# EAGLE design untitled (EAGLE 7.6.0)
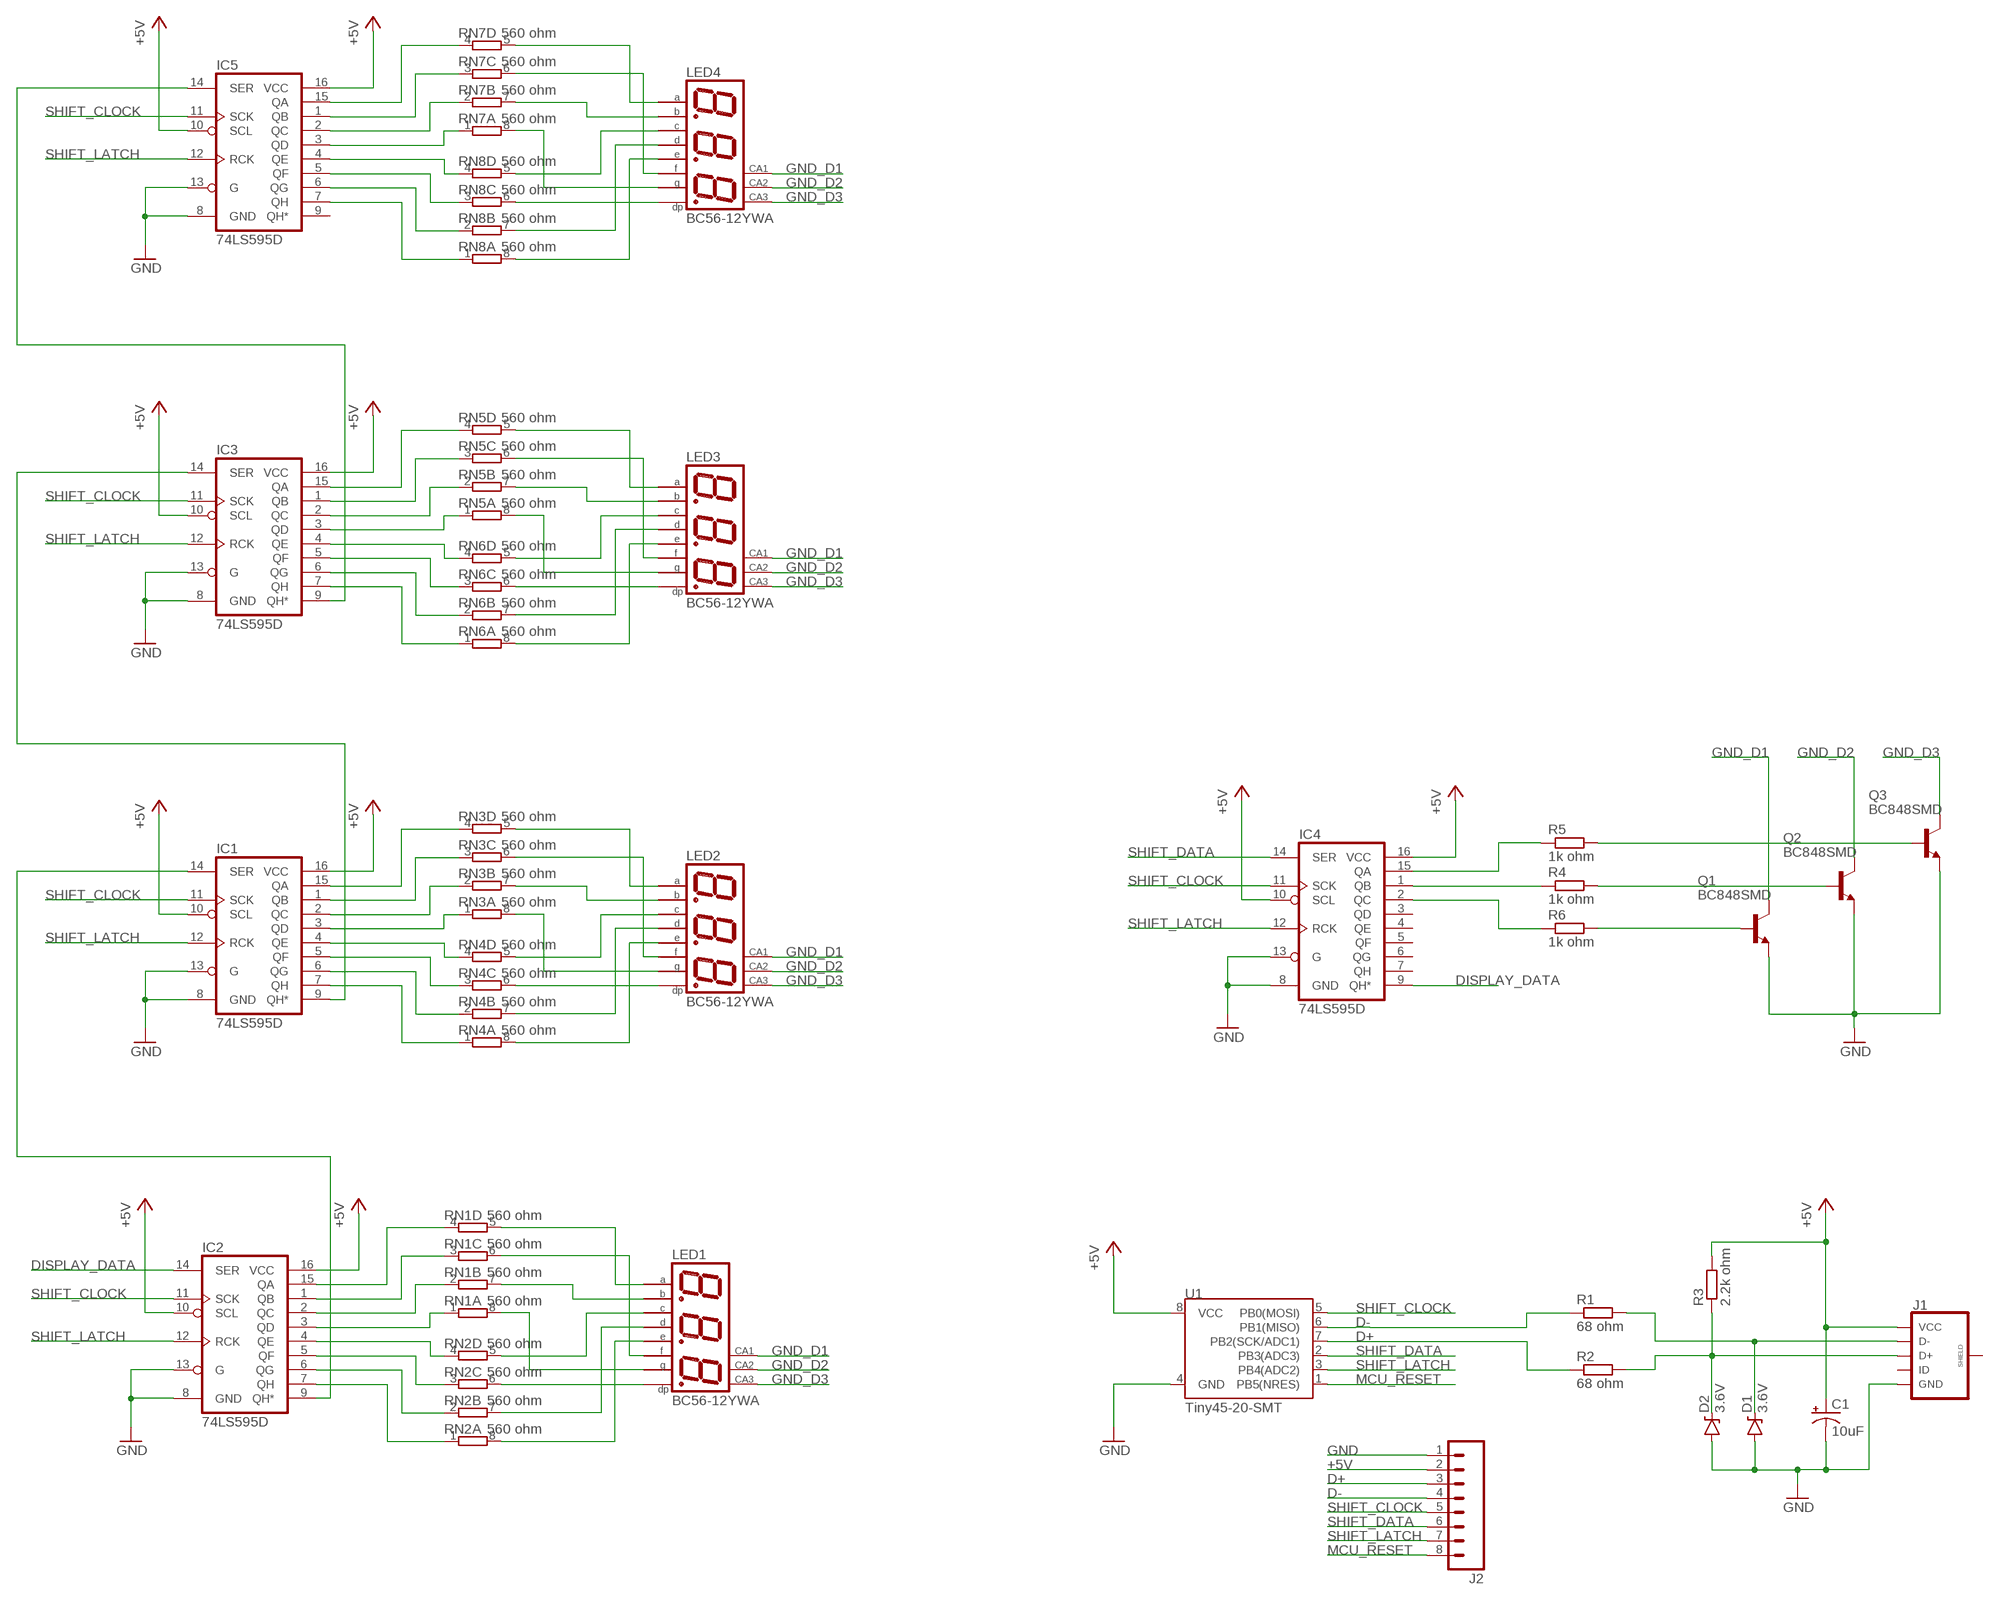
[diagram p0: schematic, sheet 1]

## Parts
C1  10uF  CAP_POLF80  [NIPPON_F80]
D1  3.6V  DIODE-ZENER3.3V  [SOD-323]
D2  3.6V  DIODE-ZENER3.3V  [SOD-323]
IC1  74LS595D  [SO16]
IC2  74LS595D  [SO16]
IC3  74LS595D  [SO16]
IC4  74LS595D  [SO16]
IC5  74LS595D  [SO16]
J1  USB_MICROB_PLUGCONN-11752  [USB-B-MICRO-SMD_V03]
J2  M08NO_SILK_FEMALE_PTH  [1X08_NO_SILK]
LED1  BC56-12YWA  [BX56-12]
LED2  BC56-12YWA  [BX56-12]
LED3  BC56-12YWA  [BX56-12]
LED4  BC56-12YWA  [BX56-12]
Q1  BC848SMD  [SOT23]
Q2  BC848SMD  [SOT23]
Q3  BC848SMD  [SOT23]
R1  68 ohm  R-EU_R0805W  [R0805W]
R2  68 ohm  R-EU_R0805W  [R0805W]
R3  2.2k ohm  R-EU_R0805W  [R0805W]
R4  1k ohm  R-EU_R0805W  [R0805W]
R5  1k ohm  R-EU_R0805W  [R0805W]
R6  1k ohm  R-EU_R0805W  [R0805W]
RN1  560 ohm  4R-NEXBS8V  [EXBS8V]
RN2  560 ohm  4R-NEXBS8V  [EXBS8V]
RN3  560 ohm  4R-NEXBS8V  [EXBS8V]
RN4  560 ohm  4R-NEXBS8V  [EXBS8V]
RN5  560 ohm  4R-NEXBS8V  [EXBS8V]
RN6  560 ohm  4R-NEXBS8V  [EXBS8V]
RN7  560 ohm  4R-NEXBS8V  [EXBS8V]
RN8  560 ohm  4R-NEXBS8V  [EXBS8V]
U1  Tiny45-20-SMT  ATTINY45TINY45-20-SMT  [SO08-EIAJ]

## Nets
+5V: C1.+ IC1.10(SCL) IC1.16(VCC) IC2.10(SCL) IC2.16(VCC) IC3.10(SCL) IC3.16(VCC) IC4.10(SCL) IC4.16(VCC) IC5.10(SCL) IC5.16(VCC) J1.VBUS(VCC) J2.2 R3.2 U1.8(VCC)
D+: J2.3 R2.1 U1.7(PB2(SCK/ADC1))
D-: J2.4 R1.1 U1.6(PB1(MISO))
DISPLAY_DATA: IC2.14(SER) IC4.9(QH*)
GND: C1.- D1.A D2.A IC1.8(GND) IC1.13(G) IC2.8(GND) IC2.13(G) IC3.8(GND) IC3.13(G) IC4.8(GND) IC4.13(G) IC5.8(GND) IC5.13(G) J1.GND J2.1 Q1.2(E) Q2.2(E) Q3.2(E) U1.4(GND)
GND_D1: LED1.12(CA) LED2.12(CA) LED3.12(CA) LED4.12(CA) Q1.3(C)
GND_D2: LED1.9(CA) LED2.9(CA) LED3.9(CA) LED4.9(CA) Q2.3(C)
GND_D3: LED1.8(CA) LED2.8(CA) LED3.8(CA) LED4.8(CA) Q3.3(C)
MCU_RESET: J2.8 U1.1(PB5(NRES))
N$1: D1.C J1.D- R1.2
N$2: D2.C J1.D+ R2.2 R3.1
N$3: IC2.15(QA) RN1.4
N$4: IC2.1(QB) RN1.3
N$7: IC2.2(QC) RN1.2
N$8: IC2.3(QD) RN1.1
N$9: IC2.4(QE) RN2.4
N$10: IC2.5(QF) RN2.3
N$11: IC2.6(QG) RN2.2
N$12: IC2.7(QH) RN2.1
N$13: LED1.4(C) RN2.5
N$14: LED1.7(B) RN1.7
N$15: LED1.11(A) RN1.5
N$16: LED1.10(F) RN1.6
N$17: LED1.5(G) RN1.8
N$18: LED1.2(D) RN2.7
N$19: LED1.3(DP) RN2.6
N$20: LED1.1(E) RN2.8
N$21: IC1.15(QA) RN3.4
N$22: IC1.1(QB) RN3.3
N$23: IC1.2(QC) RN3.2
N$24: IC1.3(QD) RN3.1
N$25: IC1.4(QE) RN4.4
N$26: IC1.5(QF) RN4.3
N$27: IC1.6(QG) RN4.2
N$28: IC1.7(QH) RN4.1
N$29: LED2.1(E) RN4.8
N$30: LED2.2(D) RN4.7
N$31: LED2.4(C) RN4.5
N$32: IC4.1(QB) R4.1
N$33: IC4.15(QA) R5.1
N$34: IC4.2(QC) R6.1
N$35: Q2.1(B) R4.2
N$36: Q3.1(B) R5.2
N$37: Q1.1(B) R6.2
N$38: LED2.7(B) RN3.7
N$39: LED2.11(A) RN3.5
N$40: LED2.10(F) RN3.6
N$41: LED2.5(G) RN3.8
N$42: LED2.3(DP) RN4.6
N$43: IC3.15(QA) RN5.4
N$44: IC3.1(QB) RN5.3
N$45: IC3.2(QC) RN5.2
N$46: IC3.3(QD) RN5.1
N$47: IC3.4(QE) RN6.4
N$48: IC3.5(QF) RN6.3
N$49: IC3.6(QG) RN6.2
N$50: IC3.7(QH) RN6.1
N$51: LED3.1(E) RN6.8
N$52: LED3.2(D) RN6.7
N$53: LED3.4(C) RN6.5
N$54: LED3.7(B) RN5.7
N$55: LED3.11(A) RN5.5
N$56: LED3.10(F) RN5.6
N$57: LED3.5(G) RN5.8
N$58: LED3.3(DP) RN6.6
N$59: IC5.15(QA) RN7.4
N$60: IC5.1(QB) RN7.3
N$61: IC5.2(QC) RN7.2
N$62: IC5.3(QD) RN7.1
N$63: IC5.4(QE) RN8.4
N$64: IC5.5(QF) RN8.3
N$65: IC5.6(QG) RN8.2
N$66: IC5.7(QH) RN8.1
N$67: LED4.1(E) RN8.8
N$68: LED4.2(D) RN8.7
N$69: LED4.4(C) RN8.5
N$70: LED4.7(B) RN7.7
N$71: LED4.11(A) RN7.5
N$72: LED4.10(F) RN7.6
N$73: LED4.5(G) RN7.8
N$74: LED4.3(DP) RN8.6
N$75: IC3.9(QH*) IC5.14(SER)
N$76: IC1.9(QH*) IC3.14(SER)
N$77: IC1.14(SER) IC2.9(QH*)
SHIFT_CLOCK: IC1.11(SCK) IC2.11(SCK) IC3.11(SCK) IC4.11(SCK) IC5.11(SCK) J2.5 U1.5(PB0(MOSI))
SHIFT_DATA: IC4.14(SER) J2.6 U1.2(PB3(ADC3))
SHIFT_LATCH: IC1.12(RCK) IC2.12(RCK) IC3.12(RCK) IC4.12(RCK) IC5.12(RCK) J2.7 U1.3(PB4(ADC2))
Unconnected: IC4.3(QD) IC4.4(QE) IC4.5(QF) IC4.6(QG) IC4.7(QH) IC5.9(QH*) J1.ID J1.SHIELD1(SHIELD) J1.SHIELD2(SHIELD) J1.SHIELD3(SHIELD)

## Library data of the parts
C1 = SparkFun-Capacitors:CAP_POL: Capacitor Polarized These are standard SMD and PTH capacitors. Normally 10uF, 47uF, and 100uF in electrolytic and tantalum varieties. Always verify the external diameter of the through hole cap, it varies with capacity, voltage, and manufacturer. The EIA devices should be standard.
D1 D2 = SparkFun-DiscreteSemi:DIODE-ZENER: Zener Diode Production Part - 8199 3.4V Zener Voltage; PROD_ID: DIO-11284; VALUE: 3.3V
IC1-IC5 = SparkFun-DigitalIC:74*595: 8-bit SHIFT REGISTER, output latch; PROD_ID: IC-07875
J1 = SparkFun-Connectors:USB_MICROB_PLUG: USB Micro-B connectors Some male, some female. Watch your step!; PROD_ID: CONN-11752
J2 = SparkFun-Connectors:M08: Header 8 Standard 8-pin 0.1" header. Use with straight break away headers (SKU : PRT-00116), right angle break away headers (PRT-00553), swiss pins (PRT-00743), machine pins (PRT-00117), and female headers (PRT-00115).; PROD_ID: CONN-08438
LED1-LED4 = display-kingbright:B?56-12*WA: 14.22mm (0.56INCH) THREE DIGIT NUMERIC DISPLAY Source: http://www.kingbright.com .. BA56-11EWA(Ver1189474895.pdf; OC_FARNELL: unknown; OC_NEWARK: unknown
Q1-Q3 = transistor-npn:BC848*: NPN Transistor
R1-R6 = resistor:R-EU_: RESISTOR, European symbol
RN1-RN8 = resistor-dil:4R-N: Array Chip Resistor Source: RS Component / Phycomp; OC_FARNELL: unknown; OC_NEWARK: unknown
U1 = SparkFun-DigitalIC:ATTINY45: Atmel 8-pin 2/4/8kB flash uC; PROD_ID: IC-08922

## Board
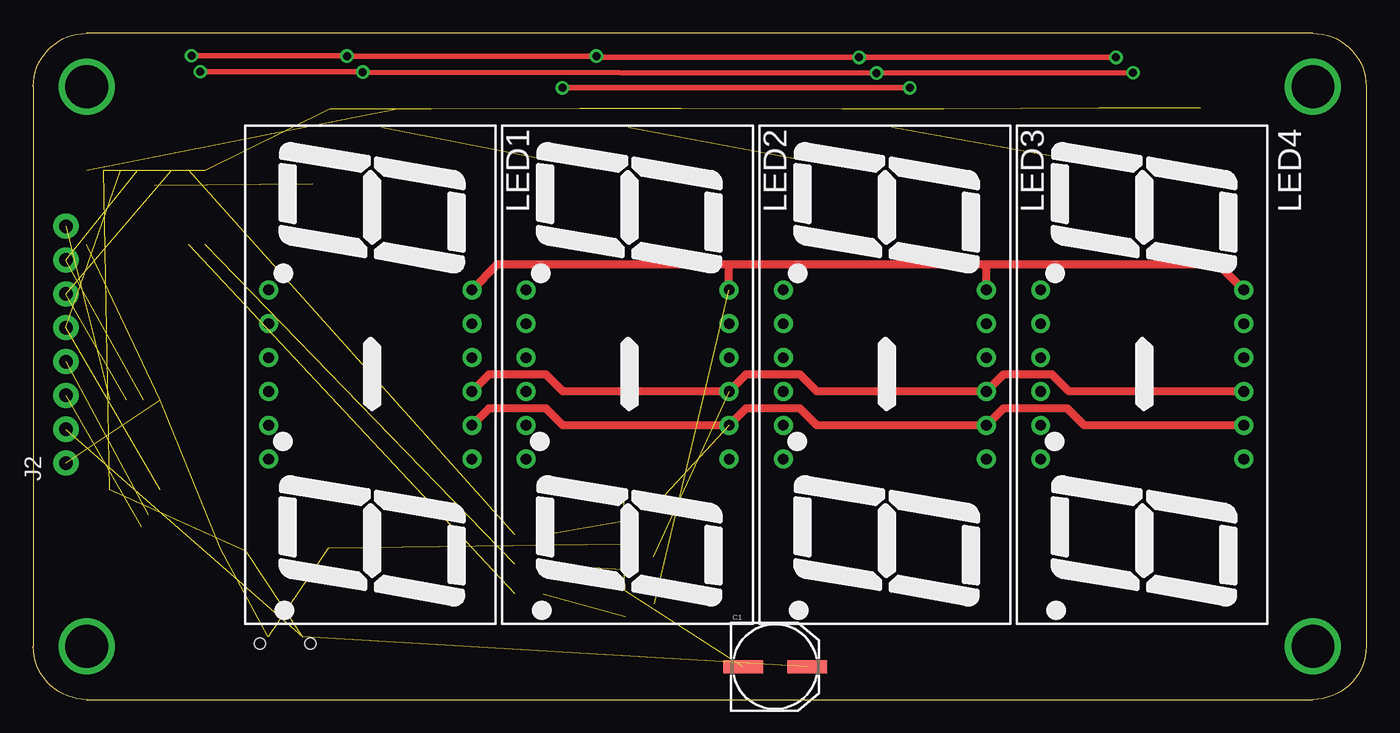
[diagram p1: board, top side]
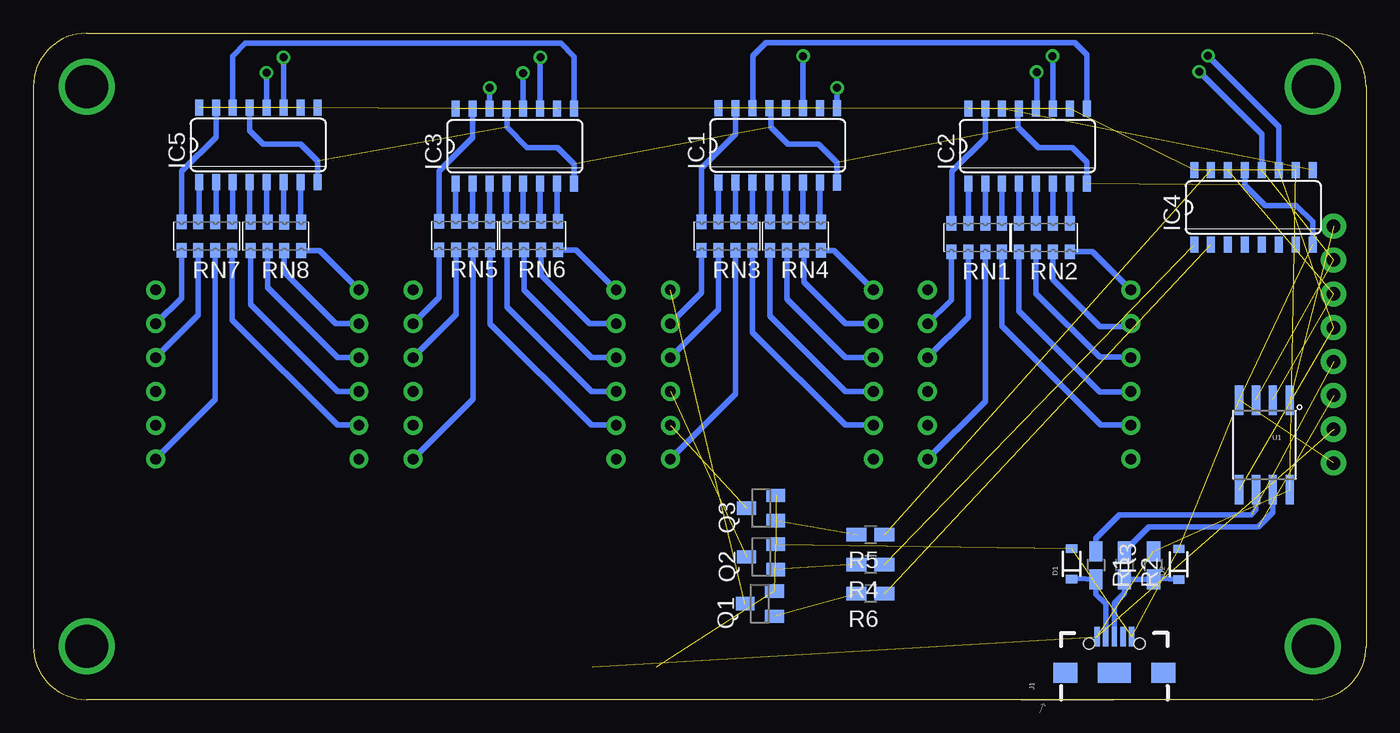
[diagram p2: board, bottom side, seen from below]

Size 100 x 50 mm. Coordinates in mm from the lower left corner, seen from the top.
Outline: 4,0 96,0 arc90 100,4 100,46 arc90 96,50 4,50 arc90 0,46 0,4 arc90 4,0
Copper layers (1*16): Top 0.035mm / dielectric 1.5mm / Bottom 0.035mm
Design rules "default": minimum track width 10mil, minimum drill 24mil, track to track 8mil, track to pad 8mil, pad to pad 8mil, via to via 8mil, smd to smd 8mil, copper to edge 40mil, drill to drill 8mil, minimum pad ring 10mil, minimum via ring 8mil, stop-mask expansion 4mil, vias tented up to drill 0mil, thermal gap 10mil

### Footprints (pad centres in the part's own frame; a part is rotated, then mirrored left to right if it is on the bottom)
NIPPON_F80 = smd 2.95 x 1: + 2.4,0; - -2.4,0
SOD-323 = smd 0.63 x 0.83: A 1.15,0; C -1.15,0
SO16 = smd 0.6 x 1.2: 1 -4.445,-2.8; 2 -3.175,-2.8; 3 -1.905,-2.8; 4 -0.635,-2.8; 5 0.635,-2.8; 6 1.905,-2.8; 7 3.175,-2.8; 8 4.445,-2.8; 9 4.445,2.8; 10 3.175,2.8; 11 1.905,2.8; 12 0.635,2.8; 13 -0.635,2.8; 14 -1.905,2.8; 15 -3.175,2.8; 16 -4.445,2.8
USB-B-MICRO-SMD_V03 = smd 1.45 x 0.4: D+ 2.725,0; D- 2.725,0.65; GND 2.725,-1.3; ID 2.725,-0.65; VBUS 2.725,1.3 | smd 1.5 x 1.8: SHIELD1 0,3.685; SHIELD2 0,-3.685 | smd 1.5 x 2.5: SHIELD3 0,0 | hole 0.85: 2.2,1.9; 2.2,-1.9
1X08_NO_SILK = drill 1.016 pad 1.88: 1 0,0; 2 2.54,0; 3 5.08,0; 4 7.62,0; 5 10.16,0; 6 12.7,0; 7 15.24,0; 8 17.78,0
BX56-12 = drill 0.8 pad 1.422: 1 -6.35,-7.62; 2 -3.81,-7.62; 3 -1.27,-7.62; 4 1.27,-7.62; 5 3.81,-7.62; 6 6.35,-7.62; 7 6.35,7.62; 8 3.81,7.62; 9 1.27,7.62; 10 -1.27,7.62; 11 -3.81,7.62; 12 -6.35,7.62
SOT23 = smd 1 x 1.4: 1 -0.95,-1.1; 2 0.95,-1.1; 3 0,1.1
R0805W = smd 1.5 x 1: 1 -1.052,0; 2 1.052,0
EXBS8V = smd 0.75 x 1.1: 1 -1.905,-1.07; 2 -0.635,-1.07; 3 0.635,-1.07; 4 1.905,-1.07; 5 1.905,1.07; 6 0.635,1.07; 7 -0.635,1.07; 8 -1.905,1.07
SO08-EIAJ = smd 0.61 x 2.21: 1 -1.905,-3.378; 2 -0.635,-3.378; 3 0.635,-3.378; 4 1.905,-3.378; 5 1.905,3.353; 6 0.635,3.353; 7 -0.635,3.353; 8 -1.905,3.353

### Placement (x,y rotation side)
C1  55.65,2.45 0 top
D1  22.1,10.18 90 bottom
D2  14.07,10.15 90 bottom
IC1  44.15,41.59 0 bottom
IC2  25.41,41.54 0 bottom
IC3  63.87,41.53 0 bottom
IC4  8.47,36.94 0 bottom
IC5  83.12,41.62 0 bottom
J1  18.9,2 90 bottom
J2  2.45,17.75 90 top
LED1  25.28,24.39 270 top
LED2  44.59,24.39 270 top
LED3  63.89,24.39 270 top
LED4  83.19,24.39 270 top
Q1  45.5,7.19 90 bottom
Q2  45.4,10.7 90 bottom
Q3  45.4,14.37 90 bottom
R1  20.28,10.08 270 bottom
R2  18.14,10.08 270 bottom
R3  15.96,10.08 90 bottom
R4  37.18,10.14 180 bottom
R5  37.18,12.37 180 bottom
R6  37.18,7.95 180 bottom
RN1  29.22,34.68 180 bottom
RN2  24.14,34.68 180 bottom
RN3  47.95,34.78 180 bottom
RN4  42.83,34.78 180 bottom
RN5  67.65,34.83 180 bottom
RN6  62.55,34.82 180 bottom
RN7  86.98,34.77 180 bottom
RN8  81.8,34.77 180 bottom
U1  7.63,19.1 180 bottom

### Tracks (layer width: path | path; a pad name or v marks a point on that pad's centre or on a via)
+5V  (14 unrouted)
D+  (1 unrouted)
  Bottom 0.406: U1.7 6.99,14.04 8.08,12.95 16.32,12.95 R2.1
D-  (1 unrouted)
  Bottom 0.406: U1.6 8.26,14.21 8.64,13.84 18.52,13.84 20.27,12.09 20.27,11.14 R1.1
DISPLAY_DATA  (1 unrouted)
GND  (13 unrouted)
  Bottom 0.406: IC2.8 20.96,40.33 22.05,41.42 24.59,41.42 26.11,42.94 26.11,44.27 IC2.13 | IC1.8 39.71,40.28 41.1,41.67 43.39,41.67 44.66,42.94 44.66,44.26 IC1.13 | IC3.8 59.43,40.19 60.66,41.42 62.94,41.42 64.47,42.94 64.47,44.28 IC3.13 | IC5.8 78.68,40.39 79.96,41.67 82.76,41.67 83.77,42.69 83.77,44.41 IC5.13 | IC4.8 4.02,35.86 5.25,37.08 7.59,37.08 9.12,38.61 9.12,39.72 IC4.13
GND_D1  (1 unrouted)
  Top 0.61: LED4.12 88.9,32.66 71.6,32.66 | 71.6,32.66 52.42,32.66 | 52.42,32.66 34.77,32.66 34.77,32.61 LED1.12 | LED2.12 52.21,32.44 52.42,32.66 | LED3.12 71.51,32.57 71.6,32.66
GND_D2  (1 unrouted)
  Top 0.61: LED4.9 77.7,23.12 76.42,24.4 72.79,24.4 LED3.9 58.78,23.12 57.5,24.4 53.48,24.4 LED2.9 39.73,23.12 38.45,24.4 34.18,24.4 LED1.9
GND_D3  (1 unrouted)
  Top 0.61: LED4.8 78.84,20.58 77.57,21.86 72.79,21.86 LED3.8 58.78,20.58 57.5,21.86 53.48,21.86 LED2.8 39.73,20.58 38.45,21.86 34.18,21.86 LED1.8
MCU_RESET  (1 unrouted)
N$1
  Bottom 0.406: D1.C 21.8,9.1 R1.2 20.27,9.02 20.27,7.9 19.55,7.18 J1.D-
N$2
  Bottom 0.406: D2.C 15.63,9.08 R3.1 R2.2 18.14,7.98 18.9,7.21 J1.D+
N$3
  Bottom 0.406: IC2.15 28.58,42.14 31.08,39.64 31.08,35.79 RN1.4
N$4
  Bottom 0.406: IC2.1 RN1.3
N$7
  Bottom 0.406: IC2.2 RN1.2
N$8
  Bottom 0.406: IC2.3 RN1.1
N$9
  Bottom 0.406: IC2.4 RN2.4
N$10
  Bottom 0.406: IC2.5 RN2.3
N$11
  Bottom 0.406: IC2.6 RN2.2
N$12
  Bottom 0.406: IC2.7 RN2.1
N$13
  Bottom 0.406: RN2.5 26.04,29.14 20,23.1 17.68,23.1 LED1.4
N$14
  Bottom 0.406: RN1.7 28.58,22.36 LED1.7
N$15
  Bottom 0.406: RN1.5 31.12,29.98 LED1.11
N$16
  Bottom 0.406: RN1.6 29.85,28.71 LED1.10
N$17
  Bottom 0.406: RN1.8 27.31,28.01 19.9,20.6 17.68,20.6 LED1.5
N$18
  Bottom 0.406: RN2.7 23.5,31.5 20,28 17.86,28 LED1.2
N$19
  Bottom 0.406: RN2.6 24.77,30.47 20,25.7 17.7,25.7 LED1.3
N$20
  Bottom 0.406: RN2.8 20.53,33.61 LED1.1
N$21
  Bottom 0.406: IC1.15 47.33,42.45 49.88,39.89 49.88,36.33 RN3.4
N$22
  Bottom 0.406: IC1.1 48.6,36.09 RN3.3
N$23
  Bottom 0.406: IC1.2 47.33,36.35 RN3.2
N$24
  Bottom 0.406: IC1.3 46.06,36.35 RN3.1
N$25
  Bottom 0.406: IC1.4 44.79,36.05 RN4.4
N$26
  Bottom 0.406: IC1.5 43.52,36.3 RN4.3
N$27
  Bottom 0.406: IC1.6 42.25,36.3 RN4.2
N$28
  Bottom 0.406: IC1.7 40.98,36.3 RN4.1
N$29
  Bottom 0.406: RN4.8 39.94,33.71 LED2.1
N$30
  Bottom 0.406: RN4.7 42.19,31.32 39.09,28.21 LED2.2
N$31
  Bottom 0.406: RN4.5 44.73,28.78 39.09,23.13 LED2.4
N$32  (1 unrouted)
N$33  (1 unrouted)
N$34  (1 unrouted)
N$35  (1 unrouted)
N$36  (1 unrouted)
N$37  (1 unrouted)
N$38
  Bottom 0.406: RN3.7 47.31,22.93 LED2.7
N$39
  Bottom 0.406: RN3.5 49.85,30.55 LED2.11
N$40
  Bottom 0.406: RN3.6 48.58,29.28 LED2.10
N$41
  Bottom 0.406: RN3.8 46.04,27.55 39.09,20.59 LED2.5
N$42
  Bottom 0.406: RN4.6 43.46,30.05 39.09,25.67 LED2.3
N$43
  Bottom 0.406: RN5.4 69.55,39.65 67.03,42.18 67.03,44.22 IC3.15
N$44
  Bottom 0.406: IC3.1 68.32,36.24 RN5.3
N$45
  Bottom 0.406: IC3.2 67.05,36.24 RN5.2
N$46
  Bottom 0.406: IC3.3 65.78,36.24 RN5.1
N$47
  Bottom 0.406: IC3.4 64.51,36.22 RN6.4
N$48
  Bottom 0.406: IC3.5 63.24,36.22 RN6.3
N$49
  Bottom 0.406: IC3.6 61.97,36.22 RN6.2
N$50
  Bottom 0.406: IC3.7 60.7,36.09 RN6.1
N$51
  Bottom 0.406: RN6.8 59.28,33.75 LED3.1
N$52
  Bottom 0.406: RN6.7 61.92,31.86 58.26,28.21 LED3.2
N$53
  Bottom 0.406: RN6.5 64.46,29.45 58.13,23.13 LED3.4
N$54
  Bottom 0.406: RN5.7 67.01,22.54 LED3.7
N$55
  Bottom 0.406: RN5.5 69.55,30.16 LED3.11
N$56
  Bottom 0.406: RN5.6 68.28,28.89 LED3.10
N$57
  Bottom 0.406: RN5.8 65.74,28.2 58.13,20.59 LED3.5
N$58
  Bottom 0.406: RN6.6 63.19,30.72 58.13,25.67 LED3.3
N$59
  Bottom 0.406: IC5.15 86.3,42.21 88.87,39.64 88.87,35.86 RN7.4
N$60
  Bottom 0.406: IC5.1 87.57,35.89 RN7.3
N$61
  Bottom 0.406: IC5.2 86.3,35.89 RN7.2
N$62
  Bottom 0.406: IC5.3 85.03,35.89 RN7.1
N$63
  Bottom 0.406: IC5.4 83.76,35.89 RN8.4
N$64
  Bottom 0.406: IC5.5 82.49,35.89 RN8.3
N$65
  Bottom 0.406: IC5.6 81.22,35.89 RN8.2
N$66
  Bottom 0.406: IC5.7 79.95,35.89 RN8.1
N$67
  Bottom 0.406: RN8.8 78.53,33.7 LED4.1
N$68
  Bottom 0.406: RN8.7 81.17,32.06 77.31,28.21 75.58,28.21 LED4.2
N$69
  Bottom 0.406: RN8.5 83.71,29.65 77.19,23.13 75.58,23.13 LED4.4
N$70
  Bottom 0.406: RN7.7 86.34,22.51 LED4.7
N$71
  Bottom 0.406: RN7.5 88.89,30.13 LED4.11
N$72
  Bottom 0.406: RN7.6 87.61,28.86 LED4.10
N$73
  Bottom 0.406: RN7.8 85.08,28.48 77.19,20.59 75.58,20.59 LED4.5
N$74
  Bottom 0.406: RN8.6 82.44,30.92 77.19,25.67 75.58,25.67 LED4.3
N$75
  Bottom 0.406: IC3.9 59.43,48.25 60.42,49.25 84.1,49.25 85.06,48.28 85.06,44.45 IC5.14
N$76  (via drill 0.6)
  Top 0.406: v39.69,45.91 65.72,45.91 v65.77,45.91
  Bottom 0.406: IC1.9 39.71,46.04 v39.69,45.91 | v65.77,45.91 65.75,44.35 IC3.14
N$77
  Bottom 0.406: IC2.9 20.96,48.41 21.85,49.29 45.03,49.29 46.02,48.3 46.02,44.43 IC1.14
N$78  (via drill 3.2)
  other vias: 4,46
N$79  (via drill 3.2)
  other vias: 96,46
N$80  (via drill 3.2)
  other vias: 96,4
N$81  (via drill 3.2)
  other vias: 4,4
SHIFT_CLOCK  (via drill 0.6)  (2 unrouted)
  Top 0.406: v81.22,48.19 81.19,48.19 v61.96,48.19 42.34,48.19 v42.24,48.28 42.24,48.3 v23.52,48.3 23.51,48.32 v11.87,48.32
  Bottom 0.406: IC2.11 23.52,48.31 v23.52,48.3 | v42.24,48.28 42.26,44.4 IC1.11 | IC3.11 61.97,48.23 | 61.97,48.23 61.97,48.49 | v81.22,48.19 IC5.11 | v61.96,48.19 61.96,48.22 61.97,48.23 | IC4.11 6.56,43.01 v11.87,48.32
SHIFT_DATA  (2 unrouted)
SHIFT_LATCH  (via drill 0.6)  (3 unrouted)
  Top 0.406: v82.5,47.05 v63.27,47.02 v24.71,47.09 24.69,47.12 v12.53,47.12
  Bottom 0.406: IC5.12 82.49,47.08 v82.5,47.05 | v24.71,47.09 24.71,44.4 IC2.12 | IC3.12 63.24,47.06 v63.27,47.02 | IC4.12 7.83,42.42 v12.53,47.12